# Altium schematic sheet Dev_BRD_ATTINY1616.SchDoc
size A4
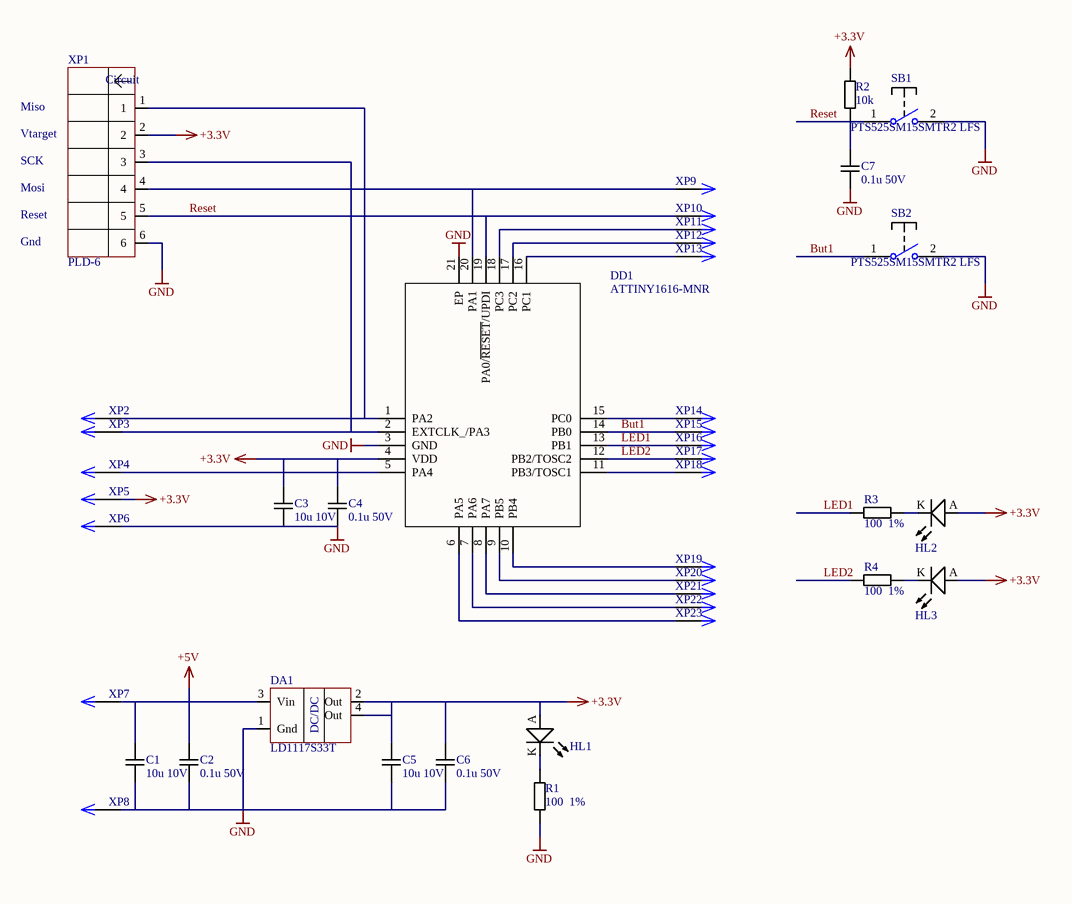
[diagram p0: Dev_BRD_ATTINY1616.SchDoc]

## Parts
C1  10u 10V  [CAPC1608(0603)N]
C2  0.1u 50V  [CAPC1608(0603)N]
C3  10u 10V  [CAPC1608(0603)N]
C4  0.1u 50V  [CAPC1608(0603)N]
C5  10u 10V  [CAPC1608(0603)N]
C6  0.1u 50V  [CAPC1608(0603)N]
C7  0.1u 50V  [CAPC1608(0603)N]
DA1  LD1117S33T  [SOT223_M]
DD1  ATTINY1616-MNR  [QFN40P300X300X90-21N]
HL1  Bl 0603  [LED-0603-BLUE]  (value not drawn)
HL2  Bl 0603  [LED-0603-BLUE]  (value not drawn)
HL3  Bl 0603  [LED-0603-BLUE]  (value not drawn)
R1  100  1%  [RESC1608(0603)N]
R2  10k  [RESC1608(0603)N]
R3  100  1%  [RESC1608(0603)N]
R4  100  1%  [RESC1608(0603)N]
SB1  PTS525SM15SMTR2 LFS  [TACT_SWITCH KPT1187B]
SB2  PTS525SM15SMTR2 LFS  [TACT_SWITCH KPT1187B]
XP1  PLD-6  [PLD-6-3D]
XP2  PLS-1  [PLS-1-3D]  (value not drawn)
XP3  PLS-1  [PLS-1-3D]  (value not drawn)
XP4  PLS-1  [PLS-1-3D]  (value not drawn)
XP5  PLS-1  [PLS-1-3D]  (value not drawn)
XP6  PLS-1  [PLS-1-3D]  (value not drawn)
XP7  PLS-1  [PLS-1-3D]  (value not drawn)
XP8  PLS-1  [PLS-1-3D]  (value not drawn)
XP9  PLS-1  [PLS-1-3D]  (value not drawn)
XP10  PLS-1  [PLS-1-3D]  (value not drawn)
XP11  PLS-1  [PLS-1-3D]  (value not drawn)
XP12  PLS-1  [PLS-1-3D]  (value not drawn)
XP13  PLS-1  [PLS-1-3D]  (value not drawn)
XP14  PLS-1  [PLS-1-3D]  (value not drawn)
XP15  PLS-1  [PLS-1-3D]  (value not drawn)
XP16  PLS-1  [PLS-1-3D]  (value not drawn)
XP17  PLS-1  [PLS-1-3D]  (value not drawn)
XP18  PLS-1  [PLS-1-3D]  (value not drawn)
XP19  PLS-1  [PLS-1-3D]  (value not drawn)
XP20  PLS-1  [PLS-1-3D]  (value not drawn)
XP21  PLS-1  [PLS-1-3D]  (value not drawn)
XP22  PLS-1  [PLS-1-3D]  (value not drawn)
XP23  PLS-1  [PLS-1-3D]  (value not drawn)

## Nets
+3.3V: C3.2 C4.1 C5.2 C6.1 DA1.2(Out) DA1.4(Out) DD1.4(VDD) HL1.A HL2.A HL3.A R2.2 XP1.2 XP5.1
+5V: C1.2 C2.1 DA1.3(Vin) XP7.1
GND: C1.1 C2.2 C3.1 C4.2 C5.1 C6.2 C7.2 DA1.1(Gnd) DD1.3(GND) DD1.21(EP) R1.1 SB1.2(NO) SB2.2(NO) XP1.6 XP6.1 XP8.1
But1: DD1.14(PB0) SB2.1(COMMON) XP15.1
LED1: DD1.13(PB1) R3.2 XP16.1
LED2: DD1.12(PB2/TOSC2) R4.2 XP17.1
Reset: C7.1 DD1.19(PA0/~{RESET}/UPDI) R2.1 SB1.1(COMMON) XP1.5 XP10.1
NetDD1_1: DD1.1(PA2) XP1.1 XP2.1
NetDD1_2: DD1.2(EXTCLK_/PA3) XP1.3 XP3.1
NetDD1_5: DD1.5(PA4) XP4.1
NetDD1_6: DD1.6(PA5) XP23.1
NetDD1_7: DD1.7(PA6) XP22.1
NetDD1_8: DD1.8(PA7) XP21.1
NetDD1_9: DD1.9(PB5) XP20.1
NetDD1_10: DD1.10(PB4) XP19.1
NetDD1_11: DD1.11(PB3/TOSC1) XP18.1
NetDD1_15: DD1.15(PC0) XP14.1
NetDD1_16: DD1.16(PC1) XP13.1
NetDD1_17: DD1.17(PC2) XP12.1
NetDD1_18: DD1.18(PC3) XP11.1
NetDD1_20: DD1.20(PA1) XP1.4 XP9.1
NetHL1_K: HL1.K R1.2
NetHL2_K: HL2.K R3.1
NetHL3_K: HL3.K R4.1

## Notes on the sheet
- Miso
- SCK
- Vtarget
- Mosi
- Reset
- Gnd
- (in symbol LD1117S33T) DC/DC
- (in symbol PLD-6) Circuit

## Library data of the parts
C1 C3 C5 = GRM188R61A106KE69J: 10uF 0603 10V X5R  10%; Part Number: GRM188R61A106KE69J; HelpURL: https://www.mouser.co.uk/ProductDetail/Murata-Electronics/GRM188R61A106KE69J?qs=sGAEpiMZZMsh%252B1woXyUXj%252BiP5dSPIHTFTsepvKq1jks%3D; Price$: 0.037; Manufacturer Part Number: GRM188R61A106KE69J; Package: 0603; Mouser Part Number: 81-GRM188R61A106KE9J
C2 C4 C6 C7 = UMF107B7104MAHT: 0,1uF 0603 50V X7R  +/-20%; Part Number: UMF107B7104MAHT; HelpURL: https://www.mouser.com/ProductDetail/Taiyo-Yuden/UMF107B7104MAHT?qs=%252B6g0mu59x7IXaZoRIc0z4w%3D%3D; Price$: 0.043; Manufacturer Part Number: UMF107B7104MAHT; Package: 0603; Mouser Part Number: 963-UMF107B7104MAHT
DA1 = LD1117S33T: LDO Voltage Regulators 3.3V 0.8A Positive; Part Number: LD1117S33T; HelpURL: http://www.mouser.com/ds/2/389/CD00000544-310772.pdf
DD1 = ATTINY1616-MNR: AVR tinyAVR™ 1 Microcontroller IC 8-Bit 20MHz 16KB (16K x 8) FLASH 20-VQFN (3x3); Manufacturer_Name: Microchip; Datasheet Link: http://ww1.microchip.com/downloads/en/DeviceDoc/ATtiny3216_ATtiny1616-data-sheet-40001997B.pdf; Height: 0.9mm; Manufacturer_Part_Number: ATTINY1616-MNR; Arrow Part Number: ATTINY1616-MNR; Arrow Price/Stock: https://www.arrow.com/en/products/attiny1616-mnr/microchip-technology; Mouser Part Number: 556-ATTINY1616MNR; Mouser Price/Stock: https://www.mouser.co.uk/ProductDetail/Microchip-Technology-Atmel/ATTINY1616-MNR?qs=HXFqYaX1Q2yKNpuKQU9qww%3D%3D; Part Number: ATTINY1616-MNR; HelpURL: https://www.digikey.com/product-detail/en/microchip-technology/ATTINY1616-MNR/ATTINY1616-MNRCT-ND/7354428; Digi-Key Part Number: ATTINY1616-MNRCT-ND; Manufacturer Part Number: ATTINY1616-MNR; Package: VQFN-20
HL1-HL3 = 150060BS55040: LED BLUE DIFFUSED 0603 SMD; Part Number: 150060BS55040; HelpURL: https://www.digikey.com/products/en?keywords=732-12013-1-ND; Digi-Key Part Number: 732-12013-1-ND; Manufacturer Part Number: 150060BS55040; Package: 0603
R1 R3 R4 = RT0603FRD07100RL: RES SMD 0603 100  1% 25ppm; Part Number: RT0603FRD07100RL; HelpURL: https://eu.mouser.com/ProductDetail/Yageo/RT0603FRD07100RL?qs=sGAEpiMZZMvdGkrng054t8YHmJ3TQuBivymLOjykzWA%3D; Manufacturer Part Number: RT0603FRD07100RL; Package: 0603; Mouser Part Number: 603-RT0603FRD07100RL
R2 = RC0603JR-0710KL: RES SMD 0603 10k 5% 100ppm; Part Number: RC0603JR-0710KL; HelpURL: https://eu.mouser.com/ProductDetail/Yageo/RC0603JR-0710KL?qs=ksOUTF%2FWcd8D6T22BJkQ7g%3D%3D; Manufacturer Part Number: RC0603JR-0710KL; Package: 0603; Mouser Part Number: 603-RC0603JR-0710KL
SB1 SB2 = PTS525SM15SMTR2 LFS: SWITCH TACTILE SPST-NO 0.02A 15V; Part Number: PTS525SM15SMTR2 LFS; HelpURL: https://www.digikey.com/products/en?keywords=CKN9104CT-ND; Digi-Key Part Number: CKN9104CT-ND; Price$: 0.33; Manufacturer Part Number: PTS525SM15SMTR2 LFS
XP2-XP23 = PLS-1: CONN HEADER VERT 1POS; Manufacturer Part Number: PRPC001SAAN-RC; Part Number: PLS-1; HelpURL: https://www.digikey.com/product-detail/en/sullins-connector-solutions/PRPC001SAAN-RC/S1011EC-01-ND/2775253; Digi-Key Part Number: S1011EC-01-ND; Price$: 0.05
XP1 = PLD-6: Part Number: PLD-6